# Altium schematic sheet 24.069.SchDoc
size A4
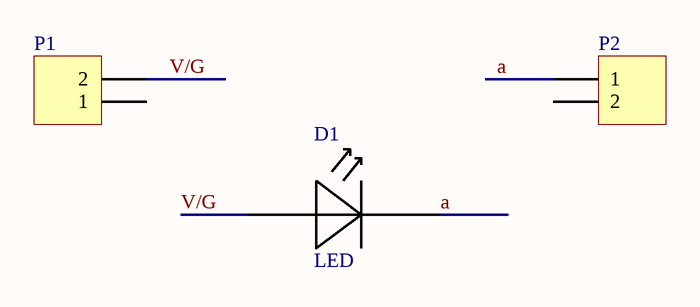
[diagram p0: 24.069.SchDoc]

## Parts
D1  LED  [LED]
P1  Header 2  [HDR1X2]  (value not drawn)
P2  Header 2  [HDR1X2]  (value not drawn)

## Nets
a: D1.2 P2.1
V/G: D1.1 P1.2

Not connected (* = marked no-connect by the designer): P1 1; P2 2

## Library data of the parts
P1 P2 = Header 2: Header, 2-Pin; LatestRevisionDate: 17-Jul-2002; LatestRevisionNote: Re-released for DXP Platform.; Publisher: Altium Limited